# Altium schematic sheet SAS_Connectors.SchDoc: FMC_ADC
size 420 x 297 mm; Author: G.Kasprowicz; CompanyName: WUT ISE; DrawnBy: G.Kasprowicz; Organization: WUT ISE; Address1: PW ISE; Address2: Nowowiejska 15/19 00-665 Warsaw; Address3: gkasprow@gmail.com; DocumentNumber: 2; Revision: 2; SheetNumber: 2; SheetTotal: 12; ModifiedBy: -; CheckedDate: -; Title2: 100M_10B_16CHA_TDC; DivGrp: WUT ISE; Designer: G.Kasprowicz; ModifiedDate: -; ProjectName: Sensor Box
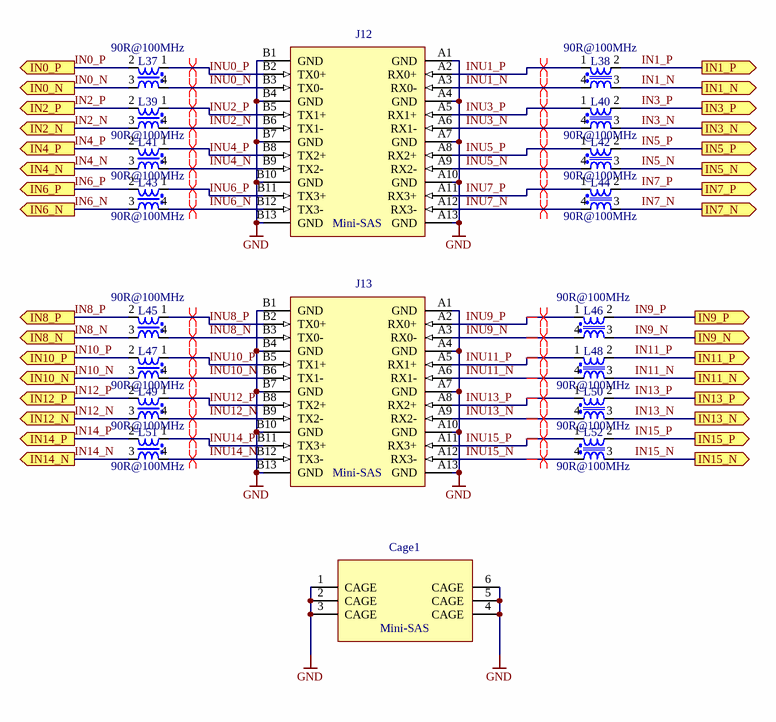
[diagram p0: SAS_Connectors.SchDoc]

## Parts
Cage1  Mini-SAS  [TYCO_1888321-2]
J12  Mini-SAS  [TYCO_1761987-7]
J13  Mini-SAS  [TYCO_1761987-7]
L37  90R@100MHz  [IND_MURATA_DLW21S]
L38  90R@100MHz  [IND_MURATA_DLW21S]
L39  90R@100MHz  [IND_MURATA_DLW21S]
L40  90R@100MHz  [IND_MURATA_DLW21S]
L41  90R@100MHz  [IND_MURATA_DLW21S]
L42  90R@100MHz  [IND_MURATA_DLW21S]
L43  90R@100MHz  [IND_MURATA_DLW21S]
L44  90R@100MHz  [IND_MURATA_DLW21S]
L45  90R@100MHz  [IND_MURATA_DLW21S]
L46  90R@100MHz  [IND_MURATA_DLW21S]
L47  90R@100MHz  [IND_MURATA_DLW21S]
L48  90R@100MHz  [IND_MURATA_DLW21S]
L49  90R@100MHz  [IND_MURATA_DLW21S]
L50  90R@100MHz  [IND_MURATA_DLW21S]
L51  90R@100MHz  [IND_MURATA_DLW21S]
L52  90R@100MHz  [IND_MURATA_DLW21S]

## Ports
IN0_N (out), IN0_P (out), IN1_N (out), IN1_P (out), IN2_N (out), IN2_P (out), IN3_N (out), IN3_P (out), IN4_N (out), IN4_P (out), IN5_N (out), IN5_P (out), IN6_N (out), IN6_P (out), IN7_N (out), IN7_P (out), IN8_N (out), IN8_P (out), IN9_N (out), IN9_P (out), IN10_N (out), IN10_P (out), IN11_N (out), IN11_P (out), IN12_N (out), IN12_P (out), IN13_N (out), IN13_P (out), IN14_N (out), IN14_P (out), IN15_N (out), IN15_P (out)

## Nets
GND: Cage1.1(CAGE) Cage1.2(CAGE) Cage1.3(CAGE) Cage1.4(CAGE) Cage1.5(CAGE) Cage1.6(CAGE) J12.A1(GND) J12.A4(GND) J12.A7(GND) J12.A10(GND) J12.A13(GND) J12.B1(GND) J12.B4(GND) J12.B7(GND) J12.B10(GND) J12.B13(GND) J13.A1(GND) J13.A4(GND) J13.A7(GND) J13.A10(GND) J13.A13(GND) J13.B1(GND) J13.B4(GND) J13.B7(GND) J13.B10(GND) J13.B13(GND)
IN0_N: L37.3 ; port IN0_N
IN0_P: L37.2 ; port IN0_P
IN1_N: L38.3 ; port IN1_N
IN1_P: L38.2 ; port IN1_P
IN2_N: L39.3 ; port IN2_N
IN2_P: L39.2 ; port IN2_P
IN3_N: L40.3 ; port IN3_N
IN3_P: L40.2 ; port IN3_P
IN4_N: L41.3 ; port IN4_N
IN4_P: L41.2 ; port IN4_P
IN5_N: L42.3 ; port IN5_N
IN5_P: L42.2 ; port IN5_P
IN6_N: L43.3 ; port IN6_N
IN6_P: L43.2 ; port IN6_P
IN7_N: L44.3 ; port IN7_N
IN7_P: L44.2 ; port IN7_P
IN8_N: L45.3 ; port IN8_N
IN8_P: L45.2 ; port IN8_P
IN9_N: L46.3 ; port IN9_N
IN9_P: L46.2 ; port IN9_P
IN10_N: L47.3 ; port IN10_N
IN10_P: L47.2 ; port IN10_P
IN11_N: L48.3 ; port IN11_N
IN11_P: L48.2 ; port IN11_P
IN12_N: L49.3 ; port IN12_N
IN12_P: L49.2 ; port IN12_P
IN13_N: L50.3 ; port IN13_N
IN13_P: L50.2 ; port IN13_P
IN14_N: L51.3 ; port IN14_N
IN14_P: L51.2 ; port IN14_P
IN15_N: L52.3 ; port IN15_N
IN15_P: L52.2 ; port IN15_P
INU0_N: J12.B3(TX0-) L37.4
INU0_P: J12.B2(TX0+) L37.1
INU1_N: J12.A3(RX0-) L38.4
INU1_P: J12.A2(RX0+) L38.1
INU2_N: J12.B6(TX1-) L39.4
INU2_P: J12.B5(TX1+) L39.1
INU3_N: J12.A6(RX1-) L40.4
INU3_P: J12.A5(RX1+) L40.1
INU4_N: J12.B9(TX2-) L41.4
INU4_P: J12.B8(TX2+) L41.1
INU5_N: J12.A9(RX2-) L42.4
INU5_P: J12.A8(RX2+) L42.1
INU6_N: J12.B12(TX3-) L43.4
INU6_P: J12.B11(TX3+) L43.1
INU7_N: J12.A12(RX3-) L44.4
INU7_P: J12.A11(RX3+) L44.1
INU8_N: J13.B3(TX0-) L45.4
INU8_P: J13.B2(TX0+) L45.1
INU9_N: J13.A3(RX0-) L46.4
INU9_P: J13.A2(RX0+) L46.1
INU10_N: J13.B6(TX1-) L47.4
INU10_P: J13.B5(TX1+) L47.1
INU11_N: J13.A6(RX1-) L48.4
INU11_P: J13.A5(RX1+) L48.1
INU12_N: J13.B9(TX2-) L49.4
INU12_P: J13.B8(TX2+) L49.1
INU13_N: J13.A9(RX2-) L50.4
INU13_P: J13.A8(RX2+) L50.1
INU14_N: J13.B12(TX3-) L51.4
INU14_P: J13.B11(TX3+) L51.1
INU15_N: J13.A12(RX3-) L52.4
INU15_P: J13.A11(RX3+) L52.1

## Layout directives
differential pair: INU0_N, INU0_P, INU1_N, INU1_P, INU2_N, INU2_P, INU3_N, INU3_P, INU4_N, INU4_P, INU5_N, INU5_P, INU6_N, INU6_P, INU7_N, INU7_P, INU8_N, INU8_P, INU9_N, INU9_P, INU10_N, INU10_P, INU11_N, INU11_P, INU12_N, INU12_P, INU13_N, INU13_P, INU14_N, INU14_P, INU15_N, INU15_P

## Notes on the sheet
- Project/Equipment
- Document
- Designer
- Drawn by
- Check.by
- Copyright WUT ISE 2018.
  This documentation describes Open Hardware and is licensed under the CERN OHL v.1.1. You may redistribute and modify this documentation under the terms of the CERN OHL v.1.1. (http://ohwr.org/CERNOHL). This documentation is distributed WITHOUT ANY EXPRESS OR IMPLIED WARRANTY, INCLUDING OF MERCHANTABILITY, SATISFACTORY QUALITY AND FITNESS FOR A PARTICULAR PURPOSE. Please see the CERN OHL v.1.1 for applicable conditions.
- Contact
- File
- Last Mod.
- Print Date
- Sheet
- Size
- A3
- of
- Rev

## Library data of the parts
Cage1 = TYCO_1888321-2: Mini-SAS Cage (6Pins); Part Description: Through Hole Dual Port EVERCLEAR Mini-SAS Cage; Manufacturer: TYCO ELECTRONICS; PressFit: No; Part Number: TYCO_1888321-2; Component Kind: Standard; Component Type: Standard; Pin Count: 10; Family: Mini-SAS; Mounted: Yes; Socket: No; SMD: No; Sense: No; Status: None; Manufacturer Part Number: 1888321-2; ComponentHeight: 8.63mm; HelpURL: \\cern.ch\dfs\Applications\Altium\Datasheets\TYCO_1888321-2.pdf; Author: CERN DEM BC; CreateDate: 04.04.2019; LatestRevisionDate: 04.04.2019
J12 J13 = TYCO_1761987-7: 26 Position Mini-Sas Connector (Quad Small Form-Factor SFF-8088); Part Description: Surface Mount EVERCLEAR Mini-SAS Right Angle Receptacle (Quad Small Form-Factor SFF-8088); Manufacturer: TYCO ELECTRONICS; PressFit: No; Part Number: TYCO_1761987-7; Component Kind: Standard; Component Type: Standard; Pin Count: 26; Family: Mini-SAS; Mounted: Yes; Socket: No; SMD: Yes; Sense: No; Status: None; Manufacturer Part Number: 1761987-7; ComponentHeight: 5.55mm; HelpURL: \\cern.ch\dfs\Applications\Altium\Datasheets\TYCO_1761987-7.pdf; Author: CERN DEM MR; CreateDate: 24.04.2019; LatestRevisionDate: 24.04.2019
L37-L52 = IND_MURATA_DLW21SN900SQ2L: Inductor Common Mode; Part Description: Wire Wound Common Mode Choke Coil (DLW21S Series); Manufacturer: MURATA; Power: 330mA; Resistance: 0.35R; Tolerance: ±25%; Part Number: IND_MURATA_DLW21SN900SQ2L; Component Kind: Standard; Component Type: Standard; Pin Count: 4; Value: 90R@100MHz; Status: None; Manufacturer Part Number: DLW21SN900SQ2L; Case: 0805; Mounted: Yes; Socket: No; SMD: Yes; Sense: No; ComponentHeight: 1.4mm; HelpURL: \\cern.ch\dfs\Applications\Altium\Datasheets\IND_MURATA_DLW21S.pdf; Author: CERN DEM JLC; CreateDate: 01.07.2014; LatestRevisionDate: 01.07.2014